# EAGLE design nrf24l01_shield (EAGLE 7.1.0)
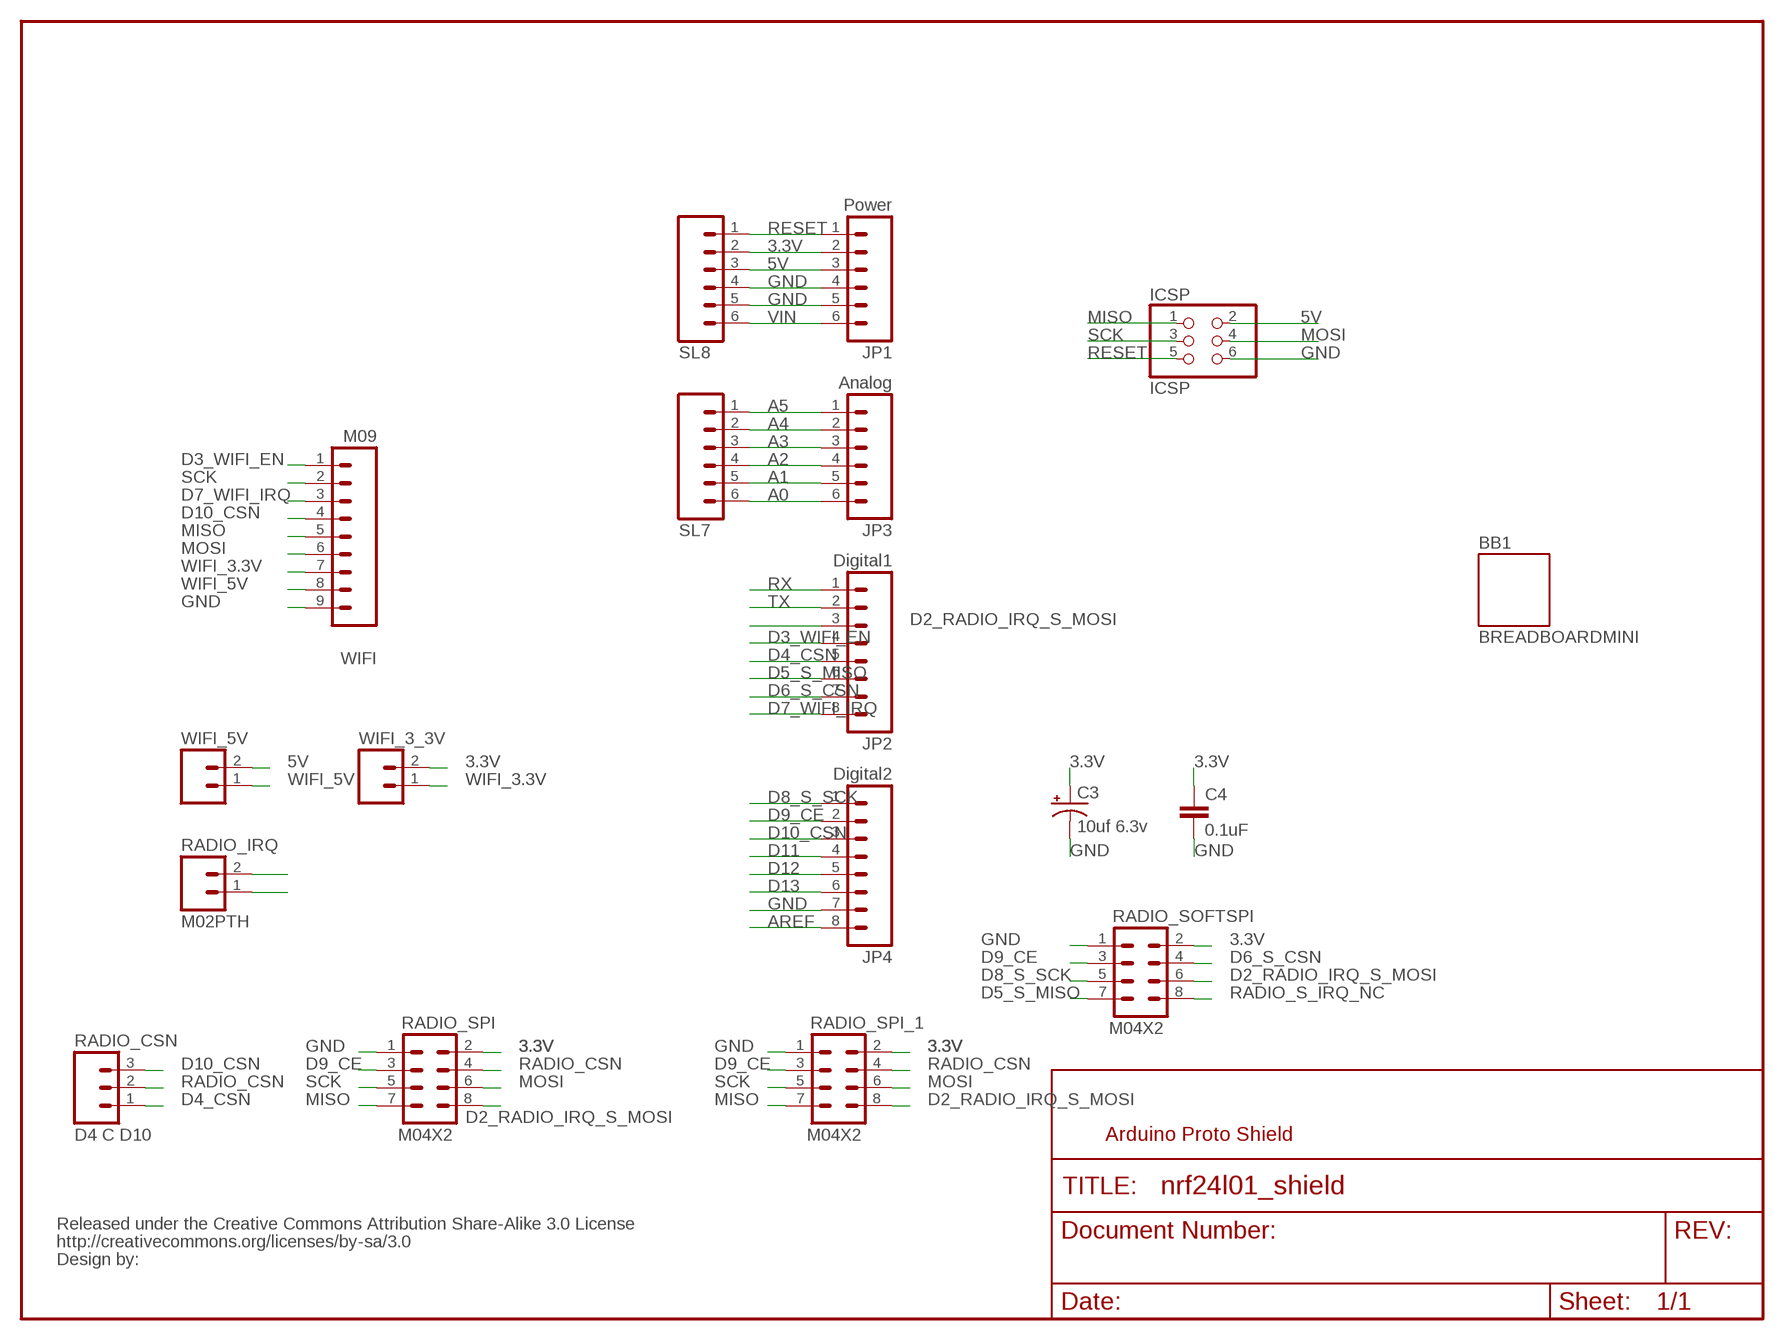
[diagram p0: schematic, sheet 1]

## Parts
BB1  BREADBOARDMINI  [BREADBOARD-MINI]
C3  10uf 6.3v  CAP_POLPTH2  [CPOL-RADIAL-10UF-25V]
C4  0.1uF  CAPPTH2  [CAP-PTH-SMALL2]
ICSP  ICSP  PINHD-2X3  [2X03]
JP1  Power  M06SIP  [1X06]
JP2  Digital1  M08  [1X08]
JP3  Analog  M06SIP  [1X06]
JP4  Digital2  M08  [1X08]
RADIO_CSN  D4 C D10  M03PTH  [1X03]
RADIO_IRQ  M02PTH  [1X02]
RADIO_SOFTSPI  M04X2  [2X4]
RADIO_SPI  M04X2  [2X4]
RADIO_SPI_1  M04X2  [2X4]
SL7  M06SIP  [1X06]
SL8  M06SIP  [1X06]
U$2  CREATIVE_COMMONS  [CREATIVE_COMMONS]
WIFI  M09  [1X09]
WIFI_3_3V  M02PTH  [1X02]
WIFI_5V  M02PTH  [1X02]

## Nets
3.3V: C3.1(+) C4.1 JP1.2 RADIO_SOFTSPI.2 RADIO_SPI.2 RADIO_SPI_1.2 SL8.2 WIFI_3_3V.2
5V [power]: ICSP.2 JP1.3 SL8.3 WIFI_5V.2
A0: JP3.6 SL7.6
A1: JP3.5 SL7.5
A2: JP3.4 SL7.4
A3: JP3.3 SL7.3
A4: JP3.2 SL7.2
A5: JP3.1 SL7.1
AREF: JP4.8
D2_RADIO_IRQ_S_MOSI: JP2.3 RADIO_SOFTSPI.6 RADIO_SPI.8 RADIO_SPI_1.8
D3_WIFI_EN: JP2.4 WIFI.1
D4_CSN: JP2.5 RADIO_CSN.1
D5_S_MISO: JP2.6 RADIO_SOFTSPI.7
D6_S_CSN: JP2.7 RADIO_SOFTSPI.4
D7_WIFI_IRQ: JP2.8 WIFI.3
D8_S_SCK: JP4.1 RADIO_SOFTSPI.5
D9_CE: JP4.2 RADIO_SOFTSPI.3 RADIO_SPI.3 RADIO_SPI_1.3
D10_CSN: JP4.3 RADIO_CSN.3 WIFI.4
D11: JP4.4
D12: JP4.5
D13: JP4.6
GND [power]: C3.2(-) C4.2 ICSP.6 JP1.4 JP1.5 JP4.7 RADIO_SOFTSPI.1 RADIO_SPI.1 RADIO_SPI_1.1 SL8.4 SL8.5 WIFI.9
MISO: ICSP.1 RADIO_SPI.7 RADIO_SPI_1.7 WIFI.5
MOSI: ICSP.4 RADIO_SPI.6 RADIO_SPI_1.6 WIFI.6
N$1: RADIO_IRQ.2
N$2: RADIO_IRQ.1
RADIO_CSN: RADIO_CSN.2 RADIO_SPI.4 RADIO_SPI_1.4
RADIO_S_IRQ_NC: RADIO_SOFTSPI.8
RESET: ICSP.5 JP1.1 SL8.1
RX: JP2.1
SCK: ICSP.3 RADIO_SPI.5 RADIO_SPI_1.5 WIFI.2
TX: JP2.2
VIN [power]: JP1.6 SL8.6
WIFI_3.3V: WIFI.7 WIFI_3_3V.1
WIFI_5V [power]: WIFI.8 WIFI_5V.1

## Notes on the sheet
- Arduino Proto Shield

## Library data of the parts
BB1 = SparkFun:BREADBOARD: Breadboard Mini Self Adhesive This is the mechnical outline for the very small self adhesive breadboard from SparkFun Electronics. Good for very small proto areas. SKU : PRT-07916
C3 = SparkFun-Passives:CAP_POL: Capacitor Polarized These are standard SMD and PTH capacitors. Normally 10uF, 47uF, and 100uF in electrolytic and tantalum varieties. Always verify the external diameter of the through hole cap, it varies with capacity, voltage, and manufacturer. The EIA devices should be standard.
C4 = SparkFun:CAP: Capacitor Standard 0603 ceramic capacitor, and 0.1" leaded capacitor.
ICSP = pinhead:PINHD-2X3: PIN HEADER
JP1 JP3 SL7 SL8 = SparkFun:M06: Header 6 Standard 6-pin 0.1" header. Use with straight break away headers (SKU : PRT-00116), right angle break away headers (PRT-00553), swiss pins (PRT-00743), machine pins (PRT-00117), and female headers (PRT-00115). Molex polarized connector foot print use with SKU : PRT-08094 with associated crimp pins and housings. NOTES ON THE VARIANTS LOCK and LOCK_LONGPADS... This footprint was designed to help hold the alignment of a through-hole component (i.e. 6-pin header) while soldering it into place. You may notice that each hole has been shifted either up or down by 0.005 of an inch from it's more standard position (which is a perfectly straight line). This slight alteration caused the pins (the squares in the middle) to touch the edges of the holes. Because they are alternating, it causes a "brace" to hold the component in place. 0.005 has proven to be the perfect amount of "off-center" position when using our standard breakaway headers. Although looks a little odd when you look at the bare footprint, once you have a header in there, the alteration is very hard to notice. Also, if you push a header all the way into place, it is covered up entirely on the bottom side. This idea of altering the position of holes to aid alignment will be further integrated into the Sparkfun Library for other footprints. It can help hold any component with 3 or more connection pins.
JP2 JP4 = SparkFun:M08: Header 8 Standard 8-pin 0.1" header. Use with straight break away headers (SKU : PRT-00116), right angle break away headers (PRT-00553), swiss pins (PRT-00743), machine pins (PRT-00117), and female headers (PRT-00115).
RADIO_CSN = SparkFun-Connectors:M03: Header 3 Standard 3-pin 0.1" header. Use with straight break away headers (SKU : PRT-00116), right angle break away headers (PRT-00553), swiss pins (PRT-00743), machine pins (PRT-00117), and female headers (PRT-00115). Molex polarized connector foot print use with SKU : PRT-08232 with associated crimp pins and housings.
RADIO_IRQ WIFI_3_3V WIFI_5V = SparkFun-Connectors:M02: Standard 2-pin 0.1" header. Use with - straight break away headers ( PRT-00116) - right angle break away headers (PRT-00553) - swiss pins (PRT-00743) - machine pins (PRT-00117) - female headers (PRT-00115) Molex polarized connector foot print use with: PRT-08233 with associated crimp pins and housings. 2.54_SCREWTERM for use with PRT-10571. 3.5mm Screw Terminal footprints for PRT-08084 5mm Screw Terminal footprints for use with PRT-08432
RADIO_SOFTSPI RADIO_SPI RADIO_SPI_1 = SparkFun-Connectors:M04X2: .1" header, two rows of four.
U$2 = SparkFun:CREATIVE_COMMONS
WIFI = SparkFun-Connectors:M09: Header 9 Standard 9-pin 0.1" header. Use with straight break away headers (SKU : PRT-00116), right angle break away headers (PRT-00553), swiss pins (PRT-00743), machine pins (PRT-00117), and female headers (PRT-00115).

## Net classes
1 power: width 0.254 mm

## Board
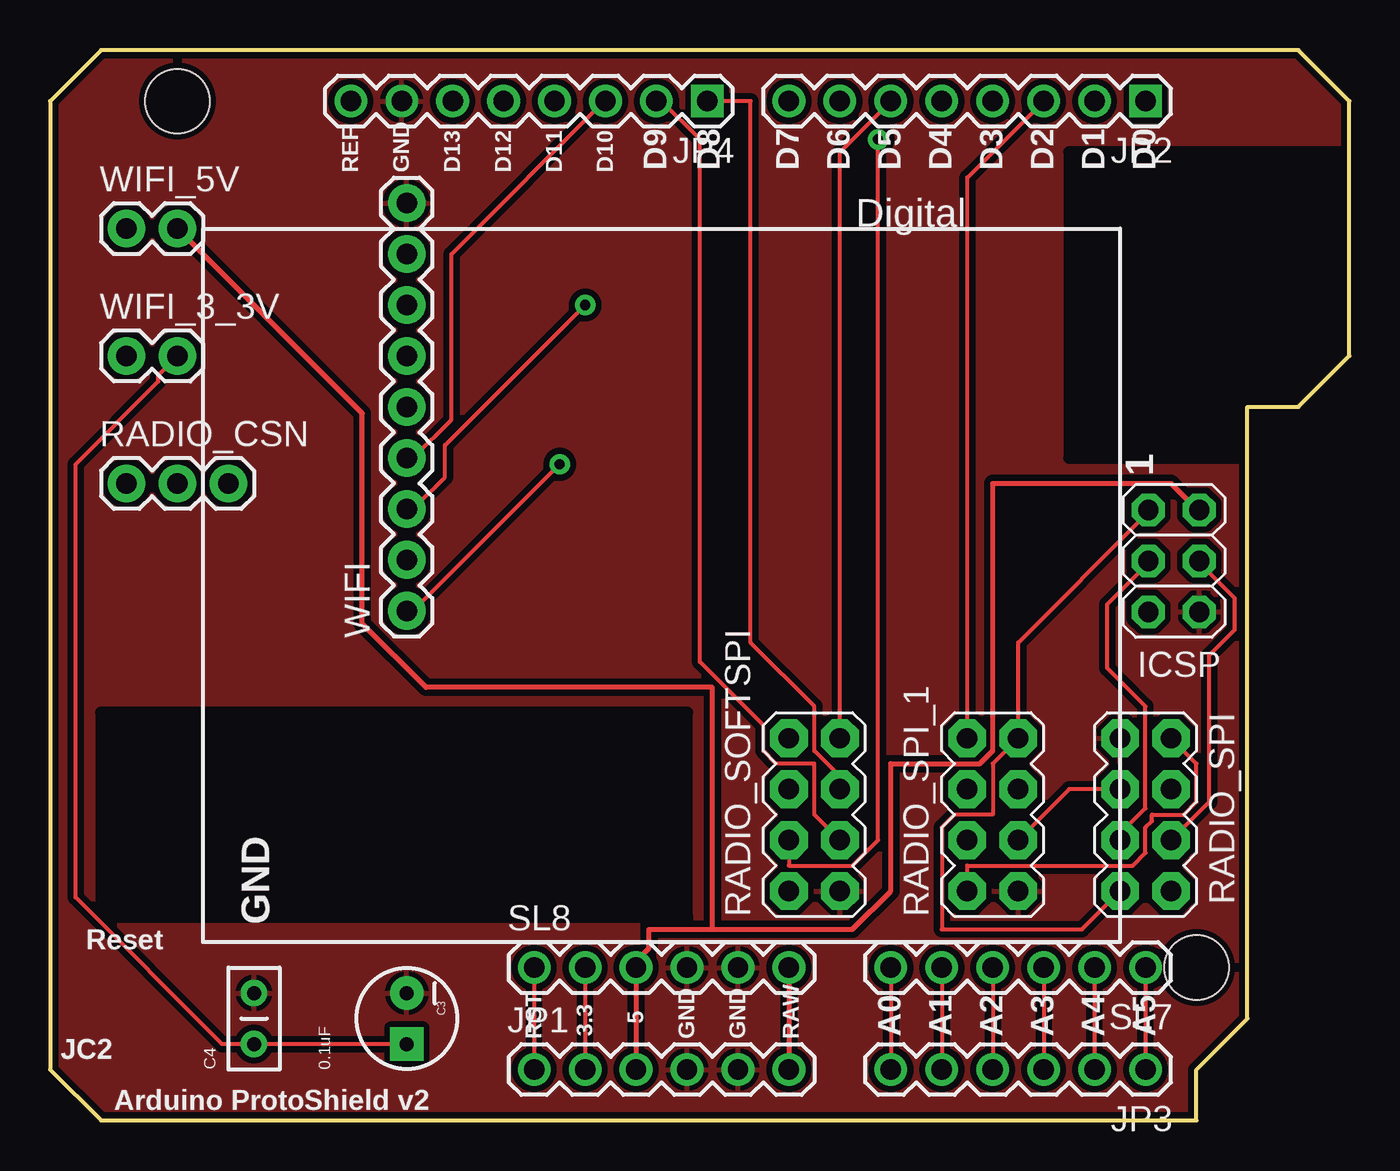
[diagram p1: board, top side]
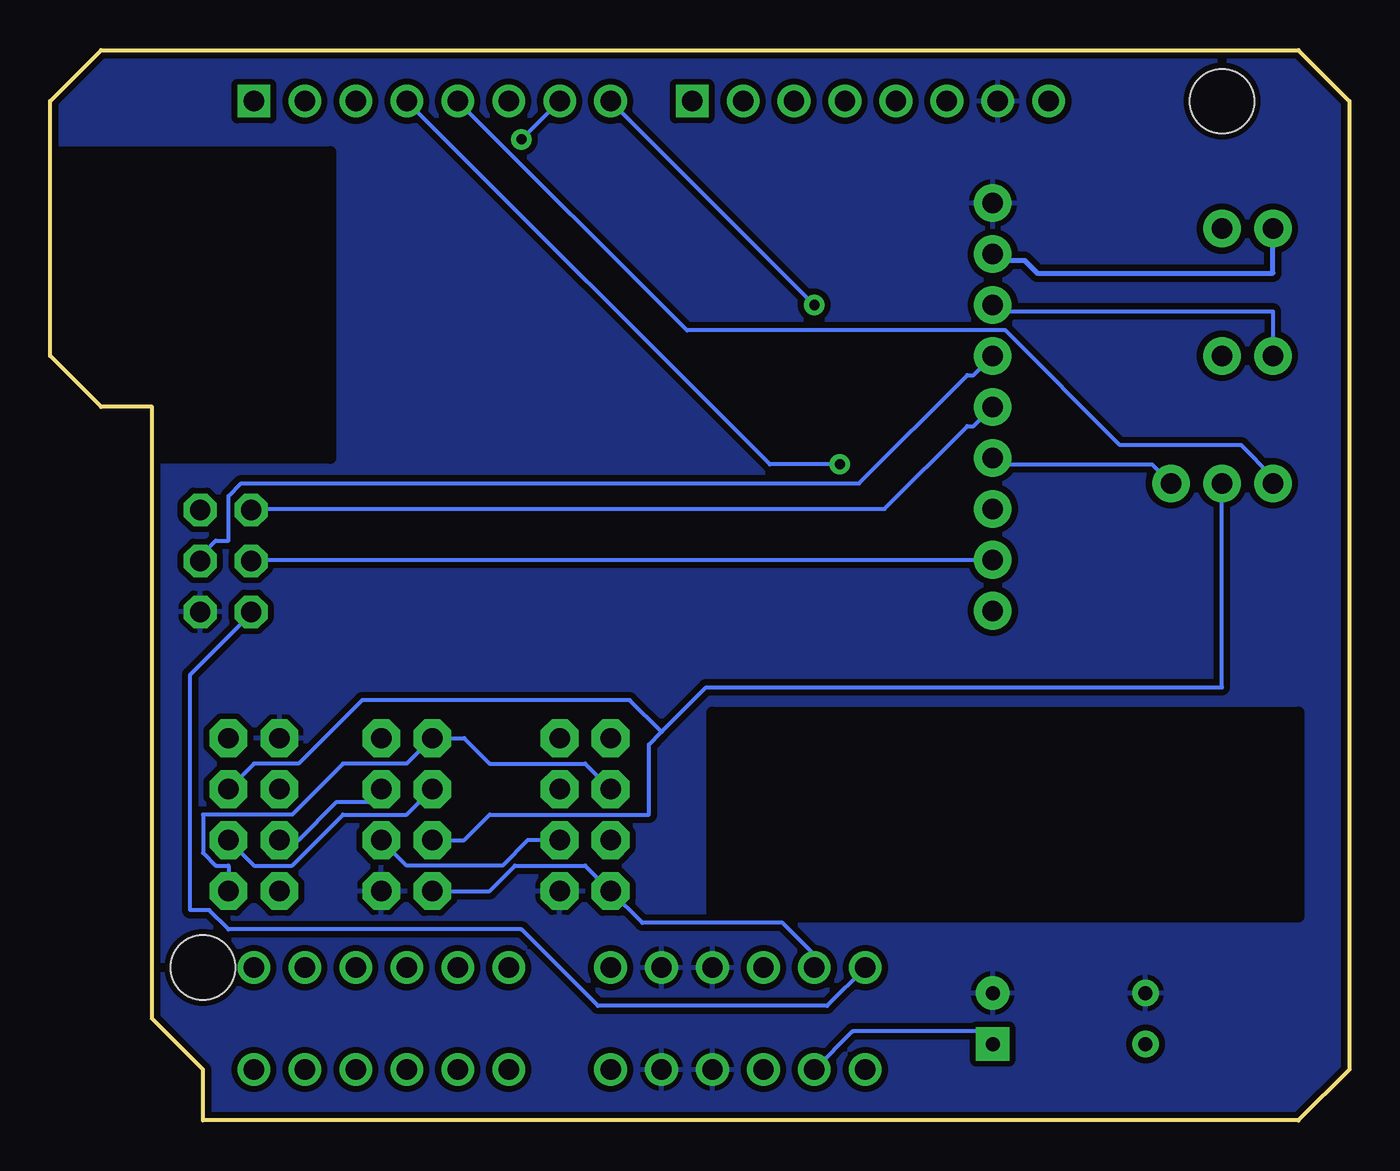
[diagram p2: board, bottom side, seen from below]

Size 64.77 x 53.34 mm. Coordinates in mm from the lower left corner, seen from the top.
Outline: 0,50.8 0,2.54 2.54,0 57.15,0 57.15,2.54 59.69,5.08 59.69,35.56 62.23,35.56 64.77,38.1 64.77,50.8 62.23,53.34 2.54,53.34 0,50.8
Copper layers (1*16): Top 0.035mm / dielectric 1.5mm / Bottom 0.035mm
Design rules "SparkFun": minimum track width 8mil, minimum drill 20mil, track to track 8mil, track to pad 8mil, pad to pad 8mil, via to via 8mil, smd to smd 8mil, copper to edge 10mil, drill to drill 8mil, minimum pad ring 12mil, minimum via ring 10mil, stop-mask expansion 4mil, vias tented up to drill 20mil, thermal gap 10mil
Holes 3.2 mm at 57.15,7.62 6.35,50.8
tRestrict: area 2.5,10.2 to 31.8,20.3; area 50.8,33 to 64.8,48.3
bRestrict: area 2.5,10.2 to 31.8,20.3; area 50.8,33 to 64.8,48.3

### Footprints (pad centres in the part's own frame; a part is rotated, then mirrored left to right if it is on the bottom)
CPOL-RADIAL-10UF-25V = drill 0.7 pad 1.651 square: 1 1.27,0 | drill 0.7 pad 1.651: 2 -1.27,0
CAP-PTH-SMALL2 = drill 0.7: 1 0,0; 2 2.54,0
2X03 = drill 1.016 octagon: 1 -2.54,-1.27; 2 -2.54,1.27; 3 0,-1.27; 4 0,1.27; 5 2.54,-1.27; 6 2.54,1.27
1X06 = drill 1.016: 1 0,0; 2 2.54,0; 3 5.08,0; 4 7.62,0; 5 10.16,0; 6 12.7,0
1X08 = drill 1.016 square: 1 0,0 | drill 1.016: 2 2.54,0; 3 5.08,0; 4 7.62,0; 5 10.16,0; 6 12.7,0; 7 15.24,0; 8 17.78,0
1X03 = drill 1.016 pad 1.88: 1 0,0; 2 2.54,0; 3 5.08,0
1X02 = drill 1.016 pad 1.88: 1 0,0; 2 2.54,0
2X4 = drill 1.016 pad 1.88 octagon: 1 -3.81,-1.27; 2 -3.81,1.27; 3 -1.27,-1.27; 4 -1.27,1.27; 5 1.27,-1.27; 6 1.27,1.27; 7 3.81,-1.27; 8 3.81,1.27
1X09 = drill 1.016 pad 1.88: 1 0,0; 2 2.54,0; 3 5.08,0; 4 7.62,0; 5 10.16,0; 6 12.7,0; 7 15.24,0; 8 17.78,0; 9 20.32,0

### Placement (x,y rotation side)
BB1  7.62,8.89 0 top
C3  17.78,5.08 270 top
C4  10.16,3.81 90 top
ICSP  56.02,27.89 270 top
JP1  24.13,2.54 0 top
JP2  54.61,50.8 180 top
JP3  54.61,2.54 180 top
JP4  32.77,50.8 180 top
RADIO_CSN  3.81,31.75 0 top
RADIO_IRQ  -19.05,-15.24 0 top  (outside the outline)
RADIO_SOFTSPI  38.1,15.24 90 top
RADIO_SPI  54.61,15.24 270 top
RADIO_SPI_1  46.99,15.24 90 top
SL7  54.61,7.62 180 top
SL8  24.13,7.62 0 top
U$2  0,-10.16 0 top  (outside the outline)
WIFI  17.78,25.4 90 top
WIFI_3_3V  3.81,38.1 0 top
WIFI_5V  3.81,44.45 0 top

### Tracks (layer width: path | path; a pad name or v marks a point on that pad's centre or on a via)
3.3V
  Top 0.203: RADIO_SPI.2 57.15,17.78 57.15,15.88 56.52,15.24 54.93,15.24 54.93,14.92 54.61,14.61 54.61,13.34 53.98,12.7 45.72,12.7 RADIO_SPI_1.2 | SL8.2 JP1.2 | C3.1 C4.1 8.57,3.81 1.27,11.11 1.27,32.7 5.4,36.83 5.4,37.15 WIFI_3_3V.2
  Bottom 0.203: RADIO_SPI_1.2 42.86,11.43 41.59,12.7 38.1,12.7 RADIO_SOFTSPI.2 35.24,9.84 28.26,9.84 26.67,8.26 SL8.2 | JP1.2 24.77,4.45 18.41,4.45 C3.1
5V
  Top 0.254: JP1.3 SL8.3 29.21,7.94 29.84,8.57 29.84,9.53 33.02,9.53 | 33.02,9.53 40.01,9.53 41.91,11.43 41.91,17.78 46.35,17.78 46.99,18.41 46.99,31.75 55.88,31.75 57.15,30.48 ICSP.2 | WIFI_5V.2 15.56,35.24 15.56,24.77 18.73,21.59 33.02,21.59 33.02,9.53
A0
  Top 0.203: SL7.6 JP3.6
A1
  Top 0.203: SL7.5 JP3.5
A2
  Top 0.203: SL7.4 JP3.4
A3
  Top 0.203: SL7.3 JP3.3
A4
  Top 0.203: SL7.2 JP3.2
A5
  Top 0.203: SL7.1 JP3.1
D2_RADIO_IRQ_S_MOSI
  Top 0.203: JP2.3 45.72,46.99 RADIO_SPI_1.8
  Bottom 0.203: RADIO_SOFTSPI.6 38.1,17.78 42.86,17.78 44.13,19.05 RADIO_SPI_1.8 46.99,17.78 50.16,17.78 52.7,15.24 57.15,15.24 57.15,13.34 56.52,12.7 55.88,12.7 RADIO_SPI.8
D3_WIFI_EN  (via drill 0.51)
  Top 0.203: v25.4,32.7 18.1,25.4 WIFI.1
  Bottom 0.203: JP2.4 28.89,32.7 v25.4,32.7
D4_CSN
  Bottom 0.203: JP2.5 33.02,39.37 17.14,39.37 11.43,33.66 5.4,33.66 3.81,32.07 RADIO_CSN.1
D5_S_MISO
  Top 0.203: JP2.6 39.37,48.26 RADIO_SOFTSPI.7
D6_S_CSN  (via drill 0.51)
  Top 0.203: v41.27,48.9 41.27,13.97 40.01,12.7 36.83,12.7 RADIO_SOFTSPI.4
  Bottom 0.203: v41.27,48.9 JP2.7
D7_WIFI_IRQ  (via drill 0.51)
  Top 0.203: v26.67,40.64 19.68,33.66 19.68,32.07 18.1,30.48 WIFI.3
  Bottom 0.203: v26.67,40.64 JP2.8
D8_S_SCK
  Top 0.203: JP4.1 34.92,50.8 34.92,23.81 38.1,20.64 38.1,18.41 39.37,17.14 RADIO_SOFTSPI.5
D9_CE
  Top 0.203: RADIO_SPI_1.3 50.8,16.51 RADIO_SPI.3 | RADIO_SOFTSPI.3 38.1,15.24 38.1,17.78 36.2,17.78 35.56,18.41 35.56,19.68 32.38,22.86 32.38,48.9 30.48,50.8 JP4.2
  Bottom 0.203: RADIO_SPI_1.3 46.99,12.7 42.23,12.7 40.96,13.97 RADIO_SOFTSPI.3
D10_CSN
  Top 0.203: WIFI.4 18.1,33.02 20,34.92 20,43.18 27.62,50.8 JP4.3
  Bottom 0.203: RADIO_CSN.3 9.84,32.7 17.46,32.7 WIFI.4
GND
  pour Bottom (isolate 0.305): 64.77,53.34 64.77,0 0,0 0,53.34
  pour Top (isolate 0.305): 64.77,53.34 64.77,0 0,0 0,53.34
MISO
  Top 0.203: ICSP.1 54.61,30.16 48.26,23.81 RADIO_SPI_1.7 46.99,17.78 46.99,15.24 45.09,15.24 44.45,14.61 44.45,9.53 51.44,9.53 RADIO_SPI.7
  Bottom 0.203: WIFI.5 18.73,34.61 19.05,34.61 23.18,30.48 54.61,30.48 ICSP.1
MOSI
  Top 0.203: RADIO_SPI.6 57.78,15.88 57.78,23.18 59.05,24.45 59.05,26.04 57.47,27.62 ICSP.4
  Bottom 0.203: WIFI.6 18.73,37.15 19.05,37.15 24.45,31.75 55.24,31.75 55.88,31.11 55.88,28.89 56.52,28.89 57.47,27.94 ICSP.4 | RADIO_SPI_1.6 46.99,15.24 50.16,15.24 52.7,12.7 54.61,12.7 RADIO_SPI.6
RADIO_CSN
  Bottom 0.203: RADIO_CSN.2 6.35,21.59 32.07,21.59 34.29,19.37 | 34.29,19.37 34.92,18.73 34.92,15.24 42.86,15.24 44.13,13.97 RADIO_SPI_1.4 | RADIO_SPI.4 54.61,17.78 52.39,17.78 49.21,20.95 35.88,20.95 34.29,19.37
RESET
  Top 0.203: SL8.1 JP1.1
  Bottom 0.203: SL8.1 26.04,5.71 37.47,5.71 41.27,9.53 55.88,9.53 56.83,10.48 57.78,10.48 57.78,22.23 54.93,25.08 ICSP.5
SCK
  Top 0.203: RADIO_SPI.5 53.34,14.29 54.61,15.56 54.61,20.64 52.7,22.54 52.7,25.72 54.61,27.62 ICSP.3
  Bottom 0.203: RADIO_SPI_1.5 48.9,15.88 50.48,15.88 52.39,13.97 RADIO_SPI.5 | WIFI.2 54.61,27.94 ICSP.3
VIN
  Top 0.254: SL8.6 JP1.6
WIFI_3.3V
  Bottom 0.203: WIFI_3_3V.1 3.81,40.32 17.46,40.32 WIFI.7
WIFI_5V
  Bottom 0.254: WIFI_5V.1 3.81,42.23 15.56,42.23 16.19,42.86 17.46,42.86 WIFI.8

### Text on the board
tPlace: REF | GND | D13 | D12 | D11 | D10 | D9 | D8 | D7 | D6 | D5 | D4 | D3 | D2 | D1 | D0 | 1 | GND | Reset | 5 | RST | 3.3 | GND | GND | RAW | A0 | A1 | A2 | A3 | A4 | A5 | JC2 | Arduino ProtoShield v2
tNames: Digital